# Altium project MainPanel.PrjPcb (part 2 of 2)

## Sheet ledsbuttons.SchDoc
size A4; SheetNumber: 14; SheetTotal: 15
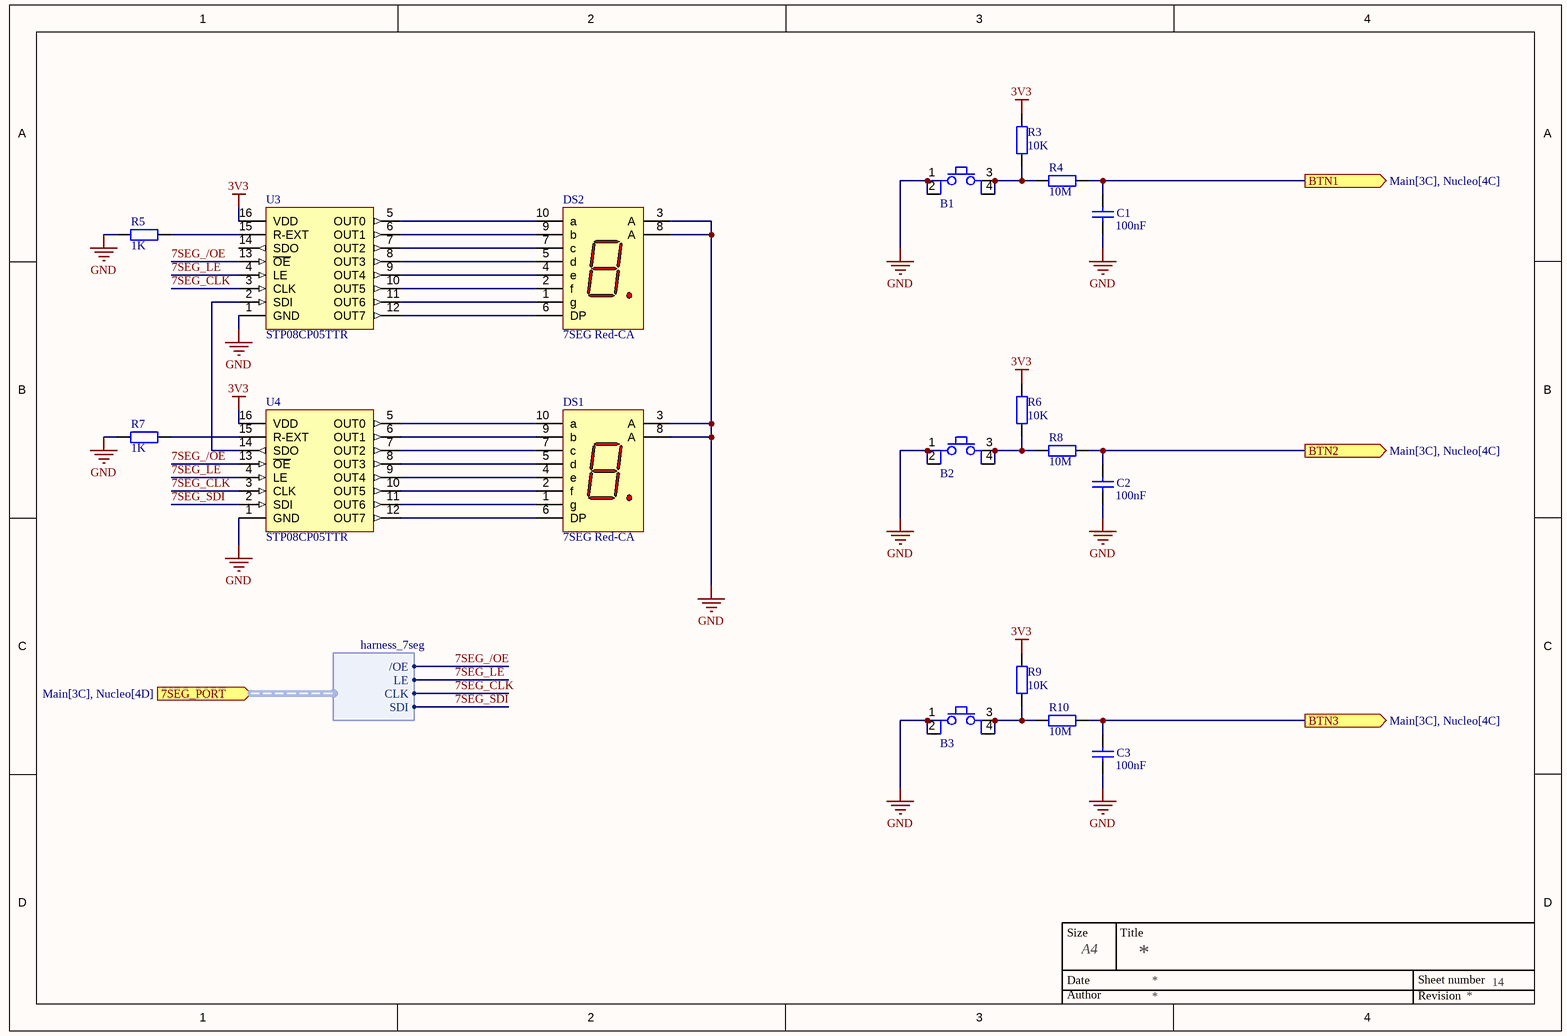
[diagram p14: ledsbuttons.SchDoc]

### Parts
B1  Button  [FP_BTN_SMD]  (value not drawn)
B2  Button  [FP_BTN_SMD]  (value not drawn)
B3  Button  [FP_BTN_SMD]  (value not drawn)
C1  100nF  [FP_0805_CAP_085]
C2  100nF  [FP_0805_CAP_085]
C3  100nF  [FP_0805_CAP_085]
DS1  7SEG Red-CA  [FP_7SEG]
DS2  7SEG Red-CA  [FP_7SEG]
R3  10K  [FP_0805_RES]
R4  10M  [FP_0805_RES]
R5  1K  [FP_0805_RES]
R6  10K  [FP_0805_RES]
R7  1K  [FP_0805_RES]
R8  10M  [FP_0805_RES]
R9  10K  [FP_0805_RES]
R10  10M  [FP_0805_RES]
U3  STP08CP05TTR  [TSOP65P640X120-16M]
U4  STP08CP05TTR  [TSOP65P640X120-16M]

### Ports
7SEG_PORT (in, harness harness_7seg, see Main[3C], Nucleo[4D]), BTN1 (out, see Main[3C], Nucleo[4C]), BTN2 (out, see Main[3C], Nucleo[4C]), BTN3 (out, see Main[3C], Nucleo[4C])

### Harnesses
harness_7seg: /OE, LE, CLK, SDI

### Nets
3V3: R3.2 R6.2 R9.2 U3.16(VDD) U4.16(VDD)
GND: B1.1 B1.2 B2.1 B2.2 B3.1 B3.2 C1.1 C2.1 C3.1 DS1.3(A) DS1.8(A) DS2.3(A) DS2.8(A) R5.2 R7.1 U3.1(GND) U4.1(GND)
7SEG_/OE: U3.13(~{OE}) U4.13(~{OE}) ; port 7SEG_PORT./OE
7SEG_CLK: U3.3(CLK) U4.3(CLK) ; port 7SEG_PORT.CLK
7SEG_LE: U3.4(LE) U4.4(LE) ; port 7SEG_PORT.LE
7SEG_SDI: U4.2(SDI) ; port 7SEG_PORT.SDI
NetB1_3: B1.3 B1.4 R3.1 R4.2
NetB2_3: B2.3 B2.4 R6.1 R8.2
NetB3_3: B3.3 B3.4 R9.1 R10.2
NetC1_2: C1.2 R4.1 ; port BTN1
NetC2_2: C2.2 R8.1 ; port BTN2
NetC3_2: C3.2 R10.1 ; port BTN3
NetDS1_1: DS1.1(g) U4.11(OUT6)
NetDS1_2: DS1.2(f) U4.10(OUT5)
NetDS1_4: DS1.4(e) U4.9(OUT4)
NetDS1_5: DS1.5(d) U4.8(OUT3)
NetDS1_6: DS1.6(DP) U4.12(OUT7)
NetDS1_7: DS1.7(c) U4.7(OUT2)
NetDS1_9: DS1.9(b) U4.6(OUT1)
NetDS1_10: DS1.10(a) U4.5(OUT0)
NetDS2_1: DS2.1(g) U3.11(OUT6)
NetDS2_2: DS2.2(f) U3.10(OUT5)
NetDS2_4: DS2.4(e) U3.9(OUT4)
NetDS2_5: DS2.5(d) U3.8(OUT3)
NetDS2_6: DS2.6(DP) U3.12(OUT7)
NetDS2_7: DS2.7(c) U3.7(OUT2)
NetDS2_9: DS2.9(b) U3.6(OUT1)
NetDS2_10: DS2.10(a) U3.5(OUT0)
NetR5_1: R5.1 U3.15(R-EXT)
NetR7_2: R7.2 U4.15(R-EXT)
NetU3_2: U3.2(SDI) U4.14(SDO)

Not connected (* = marked no-connect by the designer): U3 14(SDO)

### Notes on the sheet
- Size
- Date
- A4
- Title
- Sheet number
- Author
- Revision

### Library data of the parts
B1-B3 = Button 4P: Push button; Name: TACT 6x 6 4P SPST 2 FSM4JSMA 4-1437565-1 (TYC) 50mA 12VDC SMD H=5mm 160g BLACK HEAD; Reference: 45-05-43; Supplier: Lomex
C1-C3 = CAP: Capacitor; Name: 100nF 0805 10% 50V X7R 0805B104K500NT (FNG); Supplier: Lomex; Reference: 82-13-46; Value: 100nF
DS1 DS2 = 7SEG Red-CA: 7-Segment Display: CA, RH DP; MinimumIntensity: 360 ucd; Note: IF = 5 mA; Colour: High Efficiency Red (HER); Note: Pins 1 and 6 are redundant Anodes.; Name: FYS-3911BUHR-21 (FYL) 7 SEG SRED COM.AN. 10mm 30mcd 10x13x7mm 640nm; Published: 8-Jun-2000; LatestRevisionDate: 17-Dec-2003; LatestRevisionNote: Schematic revised, PCB Footprint replaced.; DatasheetVersion: 19-Feb-2002; PackageVersion: 11-Feb-2002; PackageReference: A; Publisher: Altium Limited; PackageDescription: LED, 7-Segment Display, 7.62 mm, RHD; 10 Leads; Row Space 5.08 mm; Pitch 2.54 mm; ComponentLink1Description: Manufacturer Link; ComponentLink1URL: http://www.agilent.com/; Reference: 35-03-94; Supplier: Lomex
R3 R6 R9 = RES: Resistor; Name: 10K0 0805 5% CR-05JL7---10K 0.125W (VIK); Supplier: Lomex; Reference: 81-10-99; Value: 10K
R4 R8 R10 = RES: Resistor; Name: 10M0 0805 5% CR-05JL7---10M 0.125W (VIK); Supplier: Lomex; Reference: 81-11-84; Value: 10M
R5 R7 = RES: Resistor; Name: 1K00 0805 5% CR-05JL7----1K 0.125W (VIK); Supplier: Lomex; Reference: 81-10-87; Value: 1K
U3 U4 = STP08CP05TTR: Low voltage, low current power 8-bit shift register; Supplier: tanszék; Reference: STP08CP05TTR; Name: STP08CP05TTR

## Nets that join several sheets
3V3: EEPROM (R?#1.3 U?.8), Interface (CN?#1.1 CN?#3.1 CN?#5.1), Camera (U2.2), Communication (*.2), Nucleo (8 pins), Measurements (IC?#1.2 IC?#1.13 IC?#2.2 IC?#2.13), Power (6 pins), Encoder (R?#53.1), DistanceSensor (6 pins), ledsbuttons (5 pins)
5V: Interface (CN?#4.1 L?#1.2), Communication (CN?#7.1), Power (5 pins), Encoder (R?#53.3), Servo (R?#54.3 R?#55.3), U_Linesensor (P1_U_Linesensor#1.2 P1_U_Linesensor#1.4), U_Linesensor (P1_U_Linesensor#2.2 P1_U_Linesensor#2.4), DistanceSensor (6 pins)
GND: EEPROM (R?#1.1 U?.1 U?.2 U?.4), Interface (6 pins), Camera (U2.1), Communication (11 pins), Nucleo (24 pins), Measurements (IC?#1.3 IC?#1.12 IC?#2.3 IC?#2.12), Power (89 pins), Encoder (CN?#14.4), Servo (CN?#15.3 CN?#16.3 CN?#17.3 CN?#18.3), MotorDriver (CN?#19.3), U_Linesensor (5 pins), U_Linesensor (5 pins), DistanceSensor (18 pins), ledsbuttons (17 pins)
VRPi: Communication (J?#1.2 J?#1.4), Power (D?#11.2 F?#5.2 J?#7.1 R?#47.2)
VServo: Power (J?#5.1 R?#25.2 R?#28.2 R?#32.1), Servo (CN?#15.1 CN?#16.1 R?#54.1 R?#55.1)
VSys: Power (20 pins), MotorDriver (CN?#19.1)
AD_CS1: Nucleo (U1.87), U_Linesensor (P1_U_Linesensor#1.8), U_Linesensor (P1_U_Linesensor#2.8)
AD_CS2: Nucleo (U1.56), U_Linesensor (P1_U_Linesensor#1.10), U_Linesensor (P1_U_Linesensor#2.10)
AD_CS3: Nucleo (U1.58), U_Linesensor (P1_U_Linesensor#1.1), U_Linesensor (P1_U_Linesensor#2.1)
AD_CS4: Nucleo (U1.101), U_Linesensor (P1_U_Linesensor#1.3), U_Linesensor (P1_U_Linesensor#2.3)
CONN_AD_MISO: Nucleo (CN?#13.3 U1.67), U_Linesensor (P1_U_Linesensor#1.7)
CONN_AD_MISO: Nucleo (CN?#12.3 U1.98), Measurements (IC?#1.15 IC?#2.15), U_Linesensor (P1_U_Linesensor#2.7)
CONN_AD_MOSI: Nucleo (CN?#13.2 U1.68), U_Linesensor (P1_U_Linesensor#1.5 P1_U_Linesensor#1.16)
CONN_AD_MOSI: Nucleo (CN?#12.2 U1.96), Measurements (IC?#1.14 IC?#2.14), U_Linesensor (P1_U_Linesensor#2.5 P1_U_Linesensor#2.16)
CONN_AD_SCK: Nucleo (CN?#12.4 U1.71), Measurements (IC?#1.16 IC?#2.16), U_Linesensor (P1_U_Linesensor#2.6 P1_U_Linesensor#2.15)
CONN_AD_SCK: Nucleo (CN?#13.4 U1.81), U_Linesensor (P1_U_Linesensor#1.6 P1_U_Linesensor#1.15)
CONN_INF_/OE: Nucleo (U1.119), U_Linesensor (P1_U_Linesensor#1.19), U_Linesensor (P1_U_Linesensor#2.19)
CONN_INF_LE: Nucleo (U1.117), U_Linesensor (P1_U_Linesensor#1.17), U_Linesensor (P1_U_Linesensor#2.17)
CONN_LED_/OE: Nucleo (U1.115), U_Linesensor (P1_U_Linesensor#1.14), U_Linesensor (P1_U_Linesensor#2.14)
CONN_LED_LE: Nucleo (U1.113), U_Linesensor (P1_U_Linesensor#1.13), U_Linesensor (P1_U_Linesensor#2.13)
I2C1_SCA: EEPROM (U?.5), Interface (CN?#3.3), Nucleo (CN?#8.3 U1.75)
I2C1_SCL: EEPROM (U?.6), Interface (CN?#3.2), Nucleo (CN?#8.2 U1.73)
I2C4_SCA: Interface (CN?#5.3), Nucleo (CN?#9.3)
I2C4_SCL: Interface (CN?#5.2), Camera (U2.3), Nucleo (CN?#9.2 U1.30)
I2C4_SDA: Camera (U2.5), Nucleo (U1.65)
NetC?#51_2: Measurements (IC?#2.9), DistanceSensor (C?#51.2 R?#59.2)
NetC?#52_2: Measurements (IC?#2.8), DistanceSensor (C?#52.2 R?#60.2)
NetC?#53_2: Measurements (IC?#2.10), DistanceSensor (C?#53.2 R?#67.2)
NetC?#54_2: Measurements (IC?#2.7), DistanceSensor (C?#54.2 R?#68.2)
NetC?#55_2: Measurements (IC?#2.11), DistanceSensor (C?#55.2 R?#75.2)
NetC?#56_2: Measurements (IC?#2.6), DistanceSensor (C?#56.2 R?#76.2)
NetCN?#21_2: Measurements (IC?#2.4), MotorDriver (CN?#21.2)
NetCN?#21_3: Measurements (IC?#2.5), MotorDriver (CN?#21.3)
NetJ?#2_2: Communication (JP?#2.2), Nucleo (J?#2.2)
NetJ?#2_4: Communication (JP?#3.2), Nucleo (J?#2.4)
NetJ?#2_10: Communication (JP?#1.2), Nucleo (J?#2.10)
OV_D0: Camera (U2.7), Nucleo (U1.89)
OV_D1: Camera (U2.10), Nucleo (U1.66)
OV_D2: Camera (U2.9), Nucleo (U1.15)
OV_D3: Camera (U2.12), Nucleo (U1.97)
OV_D4: Camera (U2.11), Nucleo (U1.123)
OV_D5: Camera (U2.14), Nucleo (U1.21)
OV_D6: Camera (U2.13), Nucleo (U1.28)
OV_D7: Camera (U2.16), Nucleo (U1.44)
OV_FLASH: Camera (D1.2), Nucleo (U1.38)
OV_HSYNC: Camera (U2.6), Nucleo (U1.103)
OV_PIXCLK: Camera (U2.15), Nucleo (U1.95)
OV_PWDN: Camera (R1.2), Nucleo (U1.129)
OV_RST: Camera (U2.8), Nucleo (U1.26)
OV_VSYNC: Camera (U2.4), Nucleo (U1.80 U1.84)
SERVO_CONN: Nucleo (U1.36), Servo (CN?#18.2)
SERVO_DIST: Nucleo (U1.32), Servo (CN?#17.2)
SERVO_FRONT: Nucleo (U1.76), Servo (CN?#15.2)
SERVO_REAR: Nucleo (U1.93), Servo (CN?#16.2)
SPI2_CLK: Communication (J?#1.23), Nucleo (U1.42)
SPI2_MISO: Communication (J?#1.21), Nucleo (U1.13)
SPI2_MOSI: Communication (J?#1.19), Nucleo (U1.128)
TIM2_CH3: Interface (CN?#4.2), Nucleo (U1.34)
TIM3_CH3: Nucleo (U1.37), MotorDriver (CN?#20.1)
TIM3_CH4: Nucleo (U1.40), MotorDriver (CN?#20.2)
TIM4_CH2: Nucleo (U1.127), Encoder (CN?#14.3)
TIM13_CH1: Communication (CN?#7.2), Nucleo (U1.83)
TIM14_CH1: Communication (CN?#7.3), Nucleo (U1.85)
TIM17_CH1: Interface (Q?#1.1), Nucleo (U1.59)
UART2_RX: Communication (*.12), Nucleo (U1.3)
UART2_TX: Communication (*.14), Nucleo (U1.61)
UART3_RX: Communication (J?#1.10), Nucleo (U1.107)
UART3_TX: Communication (J?#1.8), Nucleo (U1.105)
UART6_RX: Interface (CN?#1.3), Nucleo (CN?#10.3 U1.63)
UART6_TX: Interface (CN?#1.2), Nucleo (CN?#10.2 U1.55)